# EAGLE design schematic (EAGLE 7.3.0)
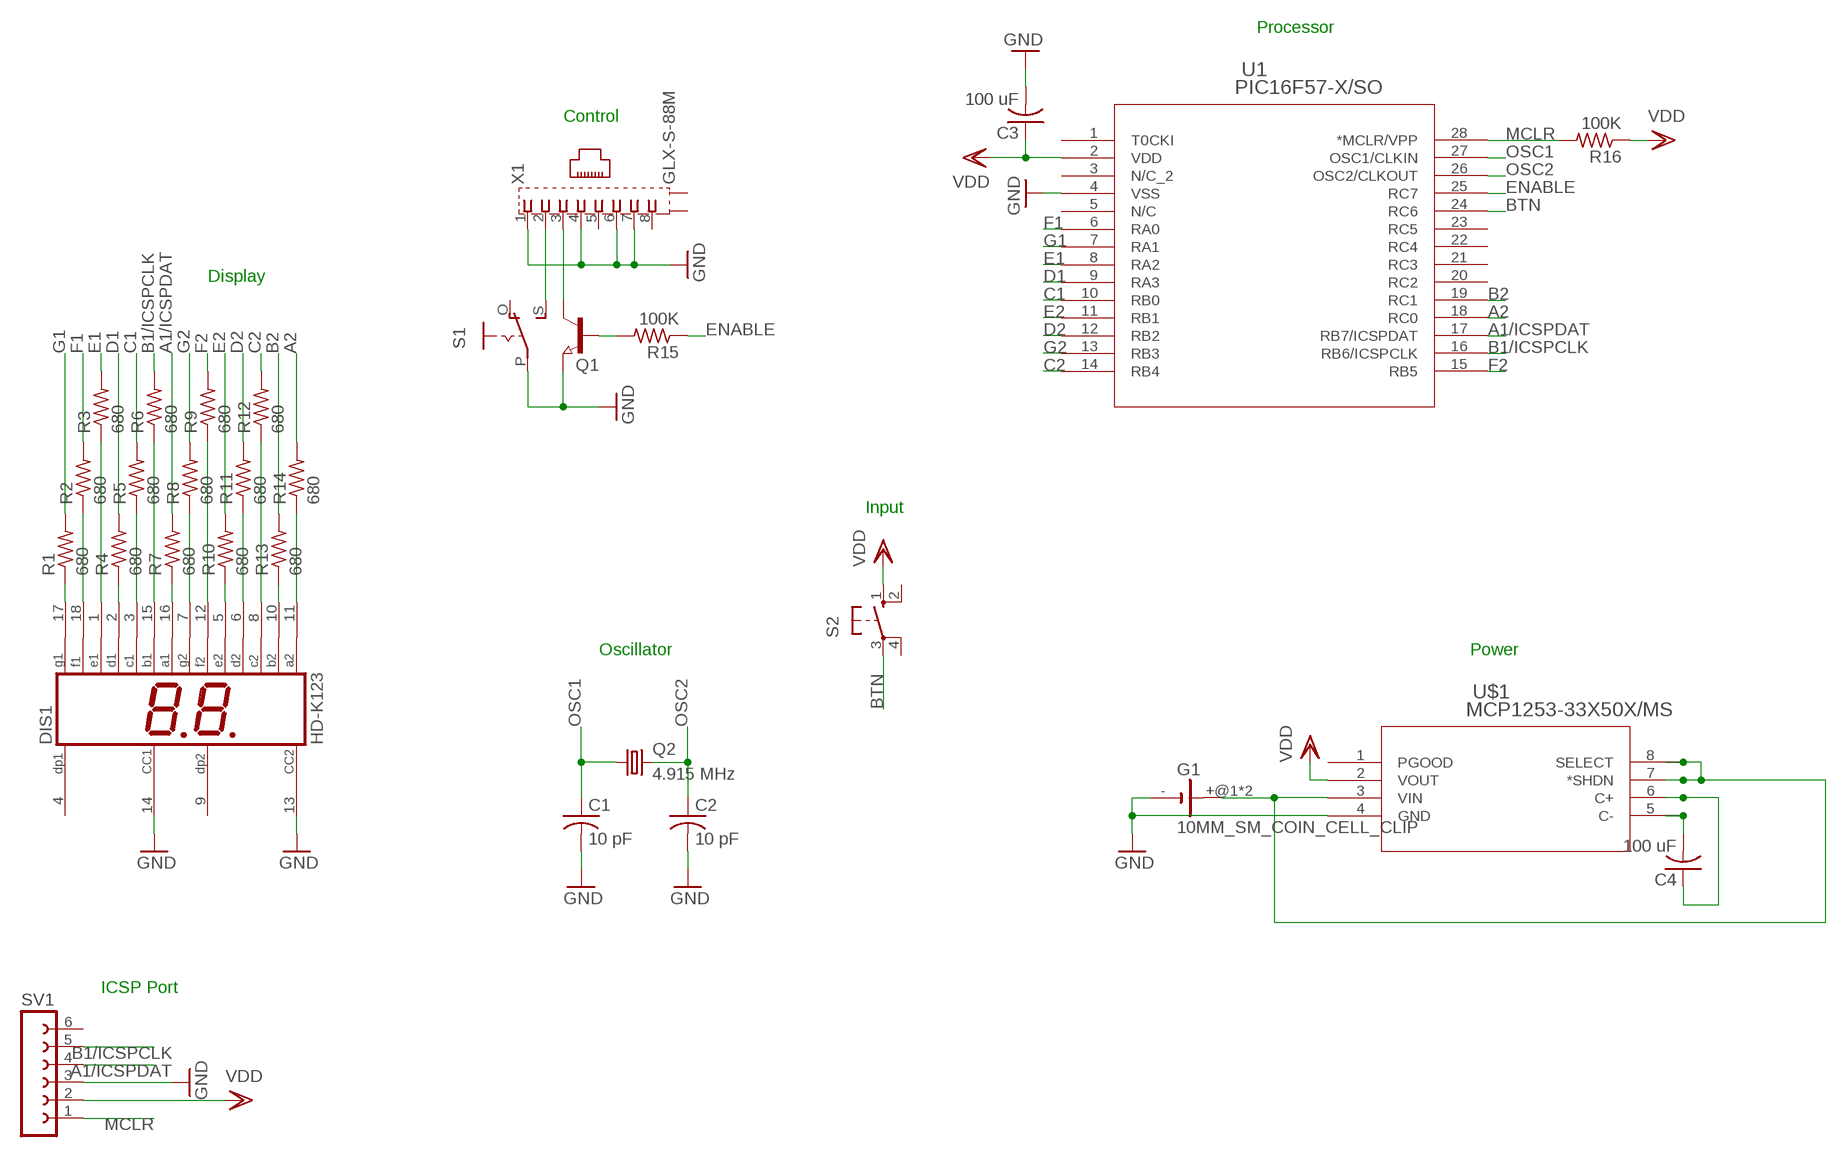
[diagram p0: schematic, sheet 1]

## Parts
C1  10 pF  C-USC0603  [C0603]
C2  10 pF  C-USC0603  [C0603]
C3  100 uF  C-USC0603  [C0603]
C4  100 uF  C-USC0603  [C0603]
DIS1  HD-K123  [HDSP-R]
G1  10MM_SM_COIN_CELL_CLIP  [10MM_SM_COIN_CELL_CLIP]
Q1  NPN-TRANSISTOR_SOT23  [SOT23]
Q2  4.915 MHz  CRYSTALSM49  [SM49]
R1  680  R-US_R0603  [R0603]
R2  680  R-US_R0603  [R0603]
R3  680  R-US_R0603  [R0603]
R4  680  R-US_R0603  [R0603]
R5  680  R-US_R0603  [R0603]
R6  680  R-US_R0603  [R0603]
R7  680  R-US_R0603  [R0603]
R8  680  R-US_R0603  [R0603]
R9  680  R-US_R0603  [R0603]
R10  680  R-US_R0603  [R0603]
R11  680  R-US_R0603  [R0603]
R12  680  R-US_R0603  [R0603]
R13  680  R-US_R0603  [R0603]
R14  680  R-US_R0603  [R0603]
R15  100K  R-US_R0603  [R0603]
R16  100K  R-US_R0603  [R0603]
S1  EG1218S  [EG1218]
S2  40-XX  [B3F-40XX]
SV1  FE06-1  [FE06]
U1  PIC16F57-X/SO  [SOIC28-W_MC]
U$1  MCP1253-33X50X/MS  [MSOP8_MC]
X1  GLX-S-88M  [GLX-S-88M]

## Nets
A1/ICSPDAT: R7.2 SV1.4 U1.17(RB7/ICSPDAT)
A2: R14.2 U1.18(RC0)
B1/ICSPCLK: R6.2 SV1.5 U1.16(RB6/ICSPCLK)
B2: R13.2 U1.19(RC1)
BTN: S2.3(P) U1.24(RC6)
C1: R5.2 U1.10(RB0)
C2: R12.2 U1.14(RB4)
D1: R4.2 U1.9(RA3)
D2: R11.2 U1.12(RB2)
E1: R3.2 U1.8(RA2)
E2: R10.2 U1.11(RB1)
ENABLE: R15.1 U1.25(RC7)
F1: R2.2 U1.6(RA0)
F2: R9.2 U1.15(RB5)
G1: R1.2 U1.7(RA1)
G2: R8.2 U1.13(RB3)
GND: C1.2 C2.2 C3.2 DIS1.13(CC2) DIS1.14(CC1) G1.- Q1.2(E) S1.P SV1.3 U1.4(VSS) U$1.4(GND) X1.1 X1.4 X1.6 X1.7
MCLR: R16.2 SV1.1 U1.28(*MCLR/VPP)
N$1: G1.+@1(+) G1.+@2(+) U$1.3(VIN) U$1.7(*SHDN) U$1.8(SELECT)
N$3: DIS1.15(B1) R6.1
N$5: DIS1.3(C1) R5.1
N$6: DIS1.2(D1) R4.1
N$7: DIS1.1(E1) R3.1
N$8: DIS1.18(F1) R2.1
N$9: DIS1.17(G1) R1.1
N$10: DIS1.16(A1) R7.1
N$11: DIS1.7(G2) R8.1
N$12: DIS1.12(F2) R9.1
N$13: DIS1.5(E2) R10.1
N$14: DIS1.6(D2) R11.1
N$15: DIS1.8(C2) R12.1
N$16: DIS1.10(B2) R13.1
N$17: DIS1.11(A2) R14.1
N$19: C4.2 U$1.5(C-)
N$20: C4.1 U$1.6(C+)
N$33: S1.S X1.2
N$34: Q1.1(B) R15.2
N$36: Q1.3(C) X1.3
OSC1: C1.1 Q2.1 U1.27(OSC1/CLKIN)
OSC2: C2.1 Q2.2 U1.26(OSC2/CLKOUT)
VDD: C3.1 R16.1 S2.1(S) SV1.2 U1.2(VDD) U$1.2(VOUT)
Unconnected: DIS1.4(DP1) DIS1.9(DP2) S1.O S2.2(S1) S2.4(P1) SV1.6 U1.1(T0CKI) U1.3(N/C_2) U1.5(N/C) U1.20(RC2) U1.21(RC3) U1.22(RC4) U1.23(RC5) U$1.1(PGOOD) X1.5 X1.8 X1.S1 X1.S2

## Notes on the sheet
- Processor
- Control
- Display
- Input
- Oscillator | Power
- ICSP Port

## Library data of the parts
C1-C4 = adafruit:C-US: CAPACITOR, American symbol
DIS1 = display-hp:HD-K123: LED DISPLAY 2 x 1 character 7 segment, decimal points right; OC_FARNELL: unknown; OC_NEWARK: unknown
G1 = battery:10MM_SM_COIN_CELL_CLIP: Battery cell clip for CR927 Source: KEYSTONE ELECTRONICS CORP. www.keyelco.com, ASTORIA, N.Y. 11105-2017 PART ANME 10mm SM COIN CELl CLIP DWG NO. 3030
Q1 = semicon-smd-ipc:NPN-TRANSISTOR_: NPN TRANSISTOR
Q2 = adafruit:CRYSTAL: CRYSTAL; OC_FARNELL: unknown; OC_NEWARK: unknown
R1-R16 = adafruit:R-US_: RESISTOR, American symbol
S1 = adafruit:EG1218: SLIDING SWITCH 0.1" spacing through hole, vertical SPDT slide switch http://www.ladyada.net/library/pcb/eaglelibrary.html
S2 = adafruit:40-XX: OMRON SWITCH; MF: OMRON COMPONENTS USA; MPN: B3F-4000; OC_FARNELL: 176434; OC_NEWARK: 36K3105
SV1 = con-lsta:FE06-1: FEMALE HEADER; OC_FARNELL: unknown; OC_NEWARK: unknown
U1 = pic16f:PIC16F57-X/SO
U$1 = mcp-pump2:MCP1253-33X50X/MS
X1 = con-kycon:GLX-S-88M: Mod. Jack, Right Angle, 8 posiotion, 8 contatcs RJ45 Source: GLX-S-88M.pdf; OC_FARNELL: unknown; OC_NEWARK: unknown

## Board
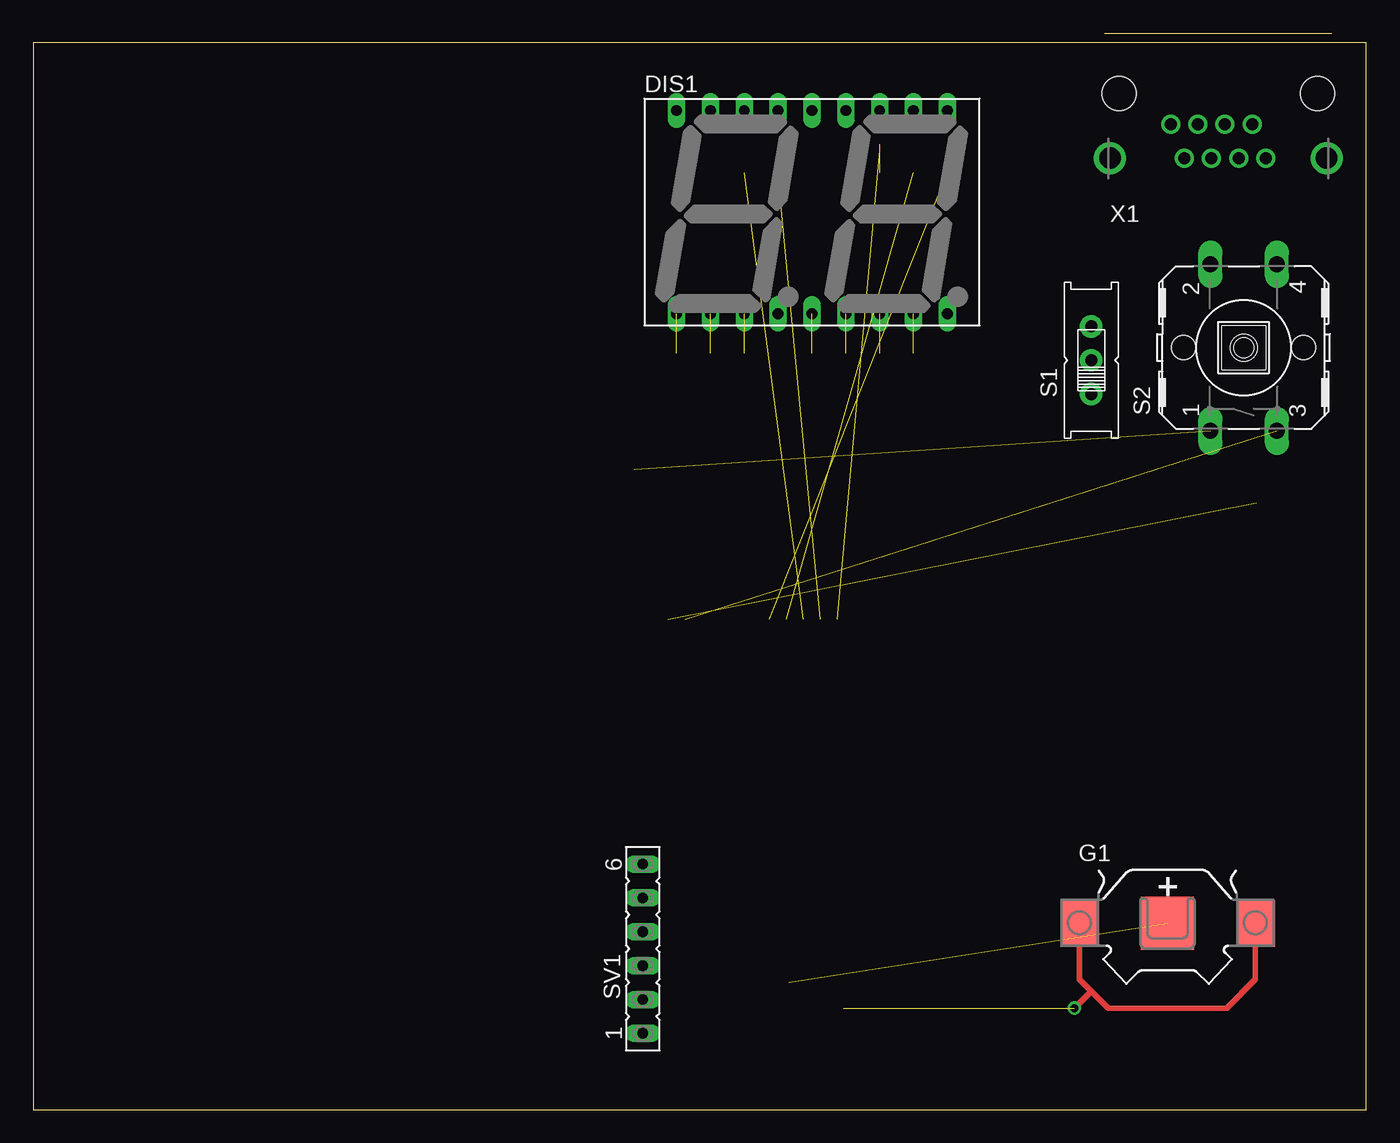
[diagram p1: board, top side]
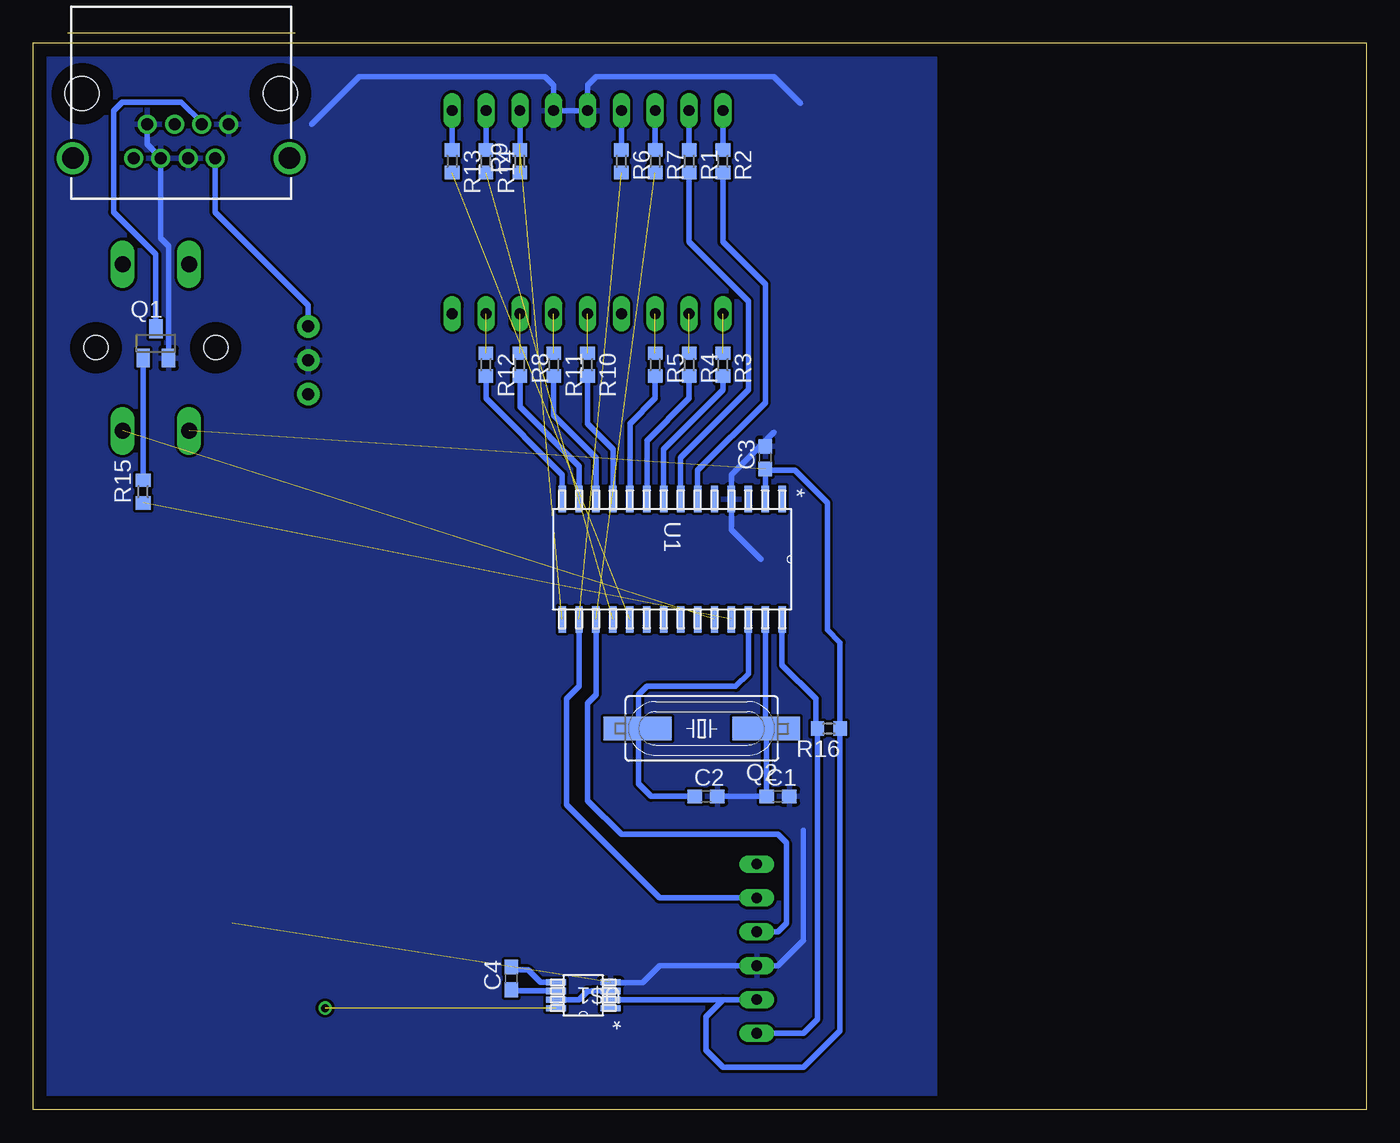
[diagram p2: board, bottom side, seen from below]

Size 100 x 80 mm. Coordinates in mm from the lower left corner, seen from the top.
Outline: 0,0 100,0 100,80 0,80 0,0
Copper layers (1*16): Top 0.035mm / dielectric 1.5mm / Bottom 0.035mm
Design rules "default": minimum track width 10mil, minimum drill 24mil, track to track 8mil, track to pad 8mil, pad to pad 8mil, via to via 8mil, smd to smd 8mil, copper to edge 40mil, drill to drill 8mil, minimum pad ring 10mil, minimum via ring 8mil, stop-mask expansion 4mil, vias tented up to drill 0mil, thermal gap 10mil

### Footprints (pad centres in the part's own frame; a part is rotated, then mirrored left to right if it is on the bottom)
C0603 = smd 1.1 x 1: 1 -0.85,0; 2 0.85,0
HDSP-R = drill 0.813 long: 1 -10.16,-7.62; 2 -7.62,-7.62; 3 -5.08,-7.62; 4 -2.54,-7.62; 5 0,-7.62; 6 2.54,-7.62; 7 5.08,-7.62; 8 7.62,-7.62; 9 10.16,-7.62; 10 10.16,7.62; 11 7.62,7.62; 12 5.08,7.62; 13 2.54,7.62; 14 0,7.62; 15 -2.54,7.62; 16 -5.08,7.62; 17 -7.62,7.62; 18 -10.16,7.62
10MM_SM_COIN_CELL_CLIP = smd 2.9 x 3.5: +@1 -6.6,0; +@2 6.6,0 | smd 3.96 x 3.96: - 0,0
SOT23 = smd 1 x 1.4: 1 -0.95,-1.1; 2 0.95,-1.1; 3 0,1.1
SM49 = smd 5.08 x 1.778: 1 -4.826,0; 2 4.826,0
R0603 = smd 1 x 1.1: 1 -0.85,0; 2 0.85,0
EG1218 = drill 0.9 pad 1.676: O -2.54,0; P 0,0; S 2.54,0
B3F-40XX = drill 1.194 long: 1 -6.248,2.489; 2 6.248,2.489; 3 -6.248,-2.489; 4 6.248,-2.489 | hole 1.803: 0,-4.496; 0,4.496
FE06 = drill 0.813 long: 1 -6.35,0; 2 -3.81,0; 3 -1.27,0; 4 1.27,0; 5 3.81,0; 6 6.35,0
SOIC28-W_MC = smd 1.981 x 0.559: 1 -4.515,8.255; 2 -4.515,6.985; 3 -4.515,5.715; 4 -4.515,4.445; 5 -4.515,3.175; 6 -4.515,1.905; 7 -4.515,0.635; 8 -4.515,-0.635; 9 -4.515,-1.905; 10 -4.515,-3.175; 11 -4.515,-4.445; 12 -4.515,-5.715; 13 -4.515,-6.985; 14 -4.515,-8.255; 15 4.515,-8.255; 16 4.515,-6.985; 17 4.515,-5.715; 18 4.515,-4.445; 19 4.515,-3.175; 20 4.515,-1.905; 21 4.515,-0.635; 22 4.515,0.635; 23 4.515,1.905; 24 4.515,3.175; 25 4.515,4.445; 26 4.515,5.715; 27 4.515,6.985; 28 4.515,8.255
MSOP8_MC = smd 1.524 x 0.457: 1 -2.044,0.975; 2 -2.044,0.325; 3 -2.044,-0.325; 4 -2.044,-0.975; 5 2.044,-0.975; 6 2.044,-0.325; 7 2.044,0.325; 8 2.044,0.975
GLX-S-88M = drill 0.9 pad 1.422: 1 -3.57,-2.3; 2 -2.55,-4.84; 3 -1.53,-2.3; 4 -0.51,-4.84; 5 0.51,-2.3; 6 1.53,-4.84; 7 2.55,-2.3; 8 3.57,-4.84 | drill 1.6 pad 2.184: S1 -8.125,-4.84; S2 8.125,-4.84 | hole 2.55: -7.44,0; 7.44,0

### Placement (x,y rotation side)
C1  44.13,23.5 0 bottom
C2  49.53,23.5 0 bottom
C3  45.09,48.9 90 bottom
C4  64.14,9.84 90 bottom
DIS1  58.42,67.31 0 top
G1  85.09,13.97 0 top
Q1  90.81,57.47 0 bottom
Q2  49.85,28.57 180 bottom
R1  50.8,71.12 270 bottom
R2  48.26,71.12 270 bottom
R3  48.26,55.88 270 bottom
R4  50.8,55.88 270 bottom
R5  53.34,55.88 270 bottom
R6  55.88,71.12 270 bottom
R7  53.34,71.12 270 bottom
R8  63.5,55.88 270 bottom
R9  63.5,71.12 90 bottom
R10  58.42,55.88 270 bottom
R11  60.96,55.88 270 bottom
R12  66.04,55.88 270 bottom
R13  68.58,71.12 270 bottom
R14  66.04,71.12 270 bottom
R15  91.76,46.35 90 bottom
R16  40.32,28.57 180 bottom
S1  79.38,56.2 90 top
S2  90.81,57.15 90 top
SV1  45.72,12.06 90 top
U1  52.07,41.27 270 bottom
U$1  58.74,8.57 180 bottom
X1  88.9,76.2 0 top

### Tracks (layer width: path | path; a pad name or v marks a point on that pad's centre or on a via)
A1/ICSPDAT  (1 unrouted)
  Bottom 0.406: U1.17 57.78,31.11 58.42,30.48 58.42,23.18 55.88,20.64 44.13,20.64 43.5,20 43.5,13.97 44.13,13.34 SV1.4
A2  (1 unrouted)
B1/ICSPCLK  (1 unrouted)
  Bottom 0.406: U1.16 59.05,31.75 60.01,30.8 60.01,22.86 53.02,15.88 SV1.5
B2  (1 unrouted)
BTN  (1 unrouted)
C1
  Bottom 0.406: U1.10 55.24,51.44 53.34,53.34 R5.2
C2
  Bottom 0.406: U1.14 60.33,47.62 66.04,53.34 R12.2
D1
  Bottom 0.406: U1.9 53.98,50.16 50.8,53.34 R4.2
D2
  Bottom 0.406: R11.2 60.96,52.07 57.78,48.9 U1.12
E1
  Bottom 0.406: U1.8 52.7,49.53 48.26,53.98 R3.2
E2
  Bottom 0.406: R10.2 58.42,51.44 56.52,49.53 U1.11
ENABLE  (1 unrouted)
F1
  Bottom 0.406: U1.6 50.16,47.94 45.09,53.02 45.09,61.91 48.26,65.09 R2.2
F2  (1 unrouted)
G1
  Bottom 0.406: U1.7 51.44,48.9 46.35,53.98 46.35,60.64 50.8,65.09 R1.2
G2
  Bottom 0.406: U1.13 59.05,48.26 63.5,52.7 R8.2
GND  (1 unrouted)
  Bottom 0.406: 79.14,73.9 75.56,77.47 61.59,77.47 60.96,76.83 DIS1.13 DIS1.14 58.42,76.83 57.78,77.47 44.45,77.47 42.44,75.46 | X1.7 91.44,72.39 90.43,71.38 X1.6 90.43,65.35 89.85,64.77 Q1.2 | 89.71,56.52 Q1.2 | 89.69,56.2 Q1.2 | 44.45,50.8 47.62,47.62 U1.4 47.62,43.5 45.4,41.27 | U$1.4 56.67,9.53 54.29,9.53 53.02,10.79 SV1.3 44.13,10.79 42.23,12.7 42.23,20.95 | 44.77,23.5 C2.2
  pour Bottom: 39.05,80.96 103.19,80.96 103.19,-1.59 34.61,-1.59 34.61,-4.13 32.38,-4.13 32.38,82.23 39.05,82.23
MCLR
  Bottom 0.406: U1.28 43.81,33.34 41.27,30.8 41.27,28.68 R16.2 41.17,6.77 42.23,5.71 SV1.1
N$1  (1 unrouted)
  Top 0.406: G1.+@2 91.69,9.78 89.53,7.62 80.64,7.62 79.38,8.89 | G1.+@1 78.49,9.78 79.38,8.89 | 79.38,8.89 78.11,7.62
  Bottom 0.406: U$1.3 58.09,8.9 58.1,8.89 58.42,8.89 59.05,8.26 U$1.7 U$1.8
N$3
  Bottom 0.406: R6.1 DIS1.15
N$4  (via drill 0.6)
  other vias: 78.11,7.62
N$5  (1 unrouted)
N$6  (1 unrouted)
N$7  (1 unrouted)
N$8
  Bottom 0.406: R2.1 DIS1.18
N$9
  Bottom 0.406: R1.1 DIS1.17
N$10
  Bottom 0.406: R7.1 DIS1.16
N$11  (1 unrouted)
N$12  (1 unrouted)
  Bottom 0.406: DIS1.12 63.5,72.39
N$13  (1 unrouted)
N$14  (1 unrouted)
N$15  (1 unrouted)
N$16
  Bottom 0.406: R13.1 DIS1.10
N$17
  Bottom 0.406: R14.1 DIS1.11
N$19
  Bottom 0.406: U$1.5 61.94,9.55 62.87,10.48 63.92,10.48 C4.2
N$20
  Bottom 0.406: U$1.6 64.04,8.9 C4.1
N$33
  Bottom 0.406: S1.S 79.38,60.33 86.36,67.31 X1.2
N$34
  Bottom 0.406: Q1.1 R15.2
N$36
  Bottom 0.406: X1.3 87.37,74.03 88.9,75.56 93.34,75.56 93.98,74.93 93.98,67.31 90.81,64.14 Q1.3
OSC1
  Bottom 0.406: U1.27 45.09,28.64 Q2.1 44.98,28.54 C1.1
OSC2
  Bottom 0.406: U1.26 46.35,32.7 47.31,31.75 53.98,31.75 54.61,31.11 54.61,28.64 Q2.2 54.61,28.51 54.61,24.45 53.66,23.5 C2.1
VDD  (1 unrouted)
  Bottom 0.406: SV1.2 45.4,8.26 45.41,8.25 48.26,8.25 | U$1.2 48.26,8.25 | 48.26,8.25 49.53,6.98 49.53,4.45 48.26,3.17 42.23,3.17 39.47,5.93 R16.1 39.47,35.03 40.42,35.98 40.42,45.51 42.86,47.94 44.98,47.94 C3.1 U1.2